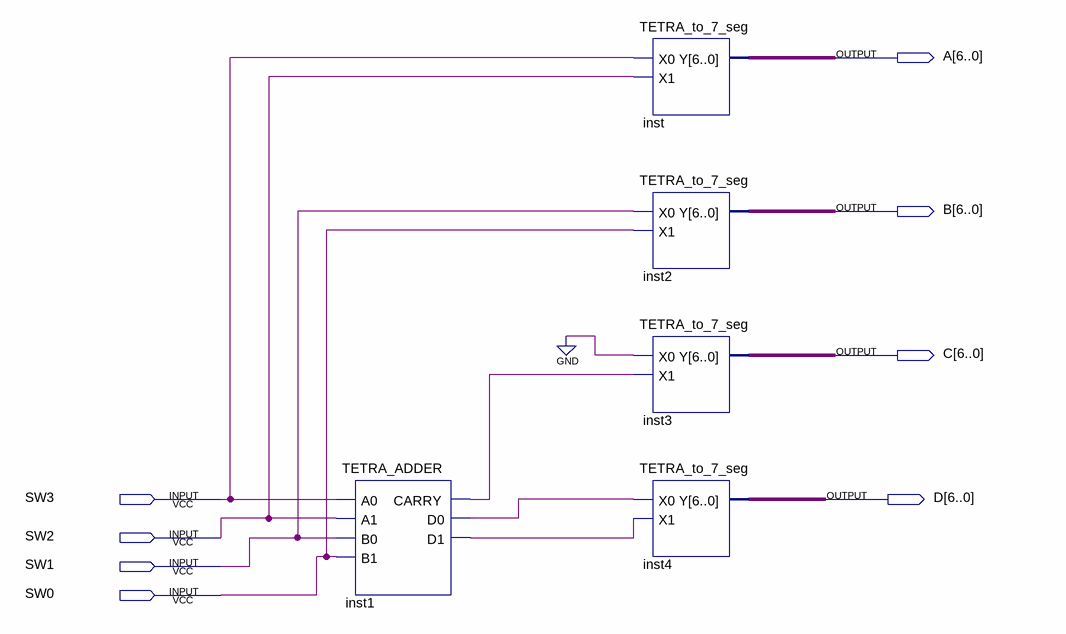
[diagram p0: schematic sheet]
// Quartus schematic Lab2.bdf as structural Verilog: 5 symbols, 8 pins
module Lab2 (
  input  SW3,
  input  SW2,
  input  SW1,
  input  SW0,
  output [6:0] A,
  output [6:0] B,
  output [6:0] C,
  output [6:0] D
);

  wire inst1_carry, inst1_d0, inst1_d1;

  TETRA_ADDER inst1 (.A0(SW3), .A1(SW2), .B0(SW1), .B1(SW0), .CARRY(inst1_carry), .D0(inst1_d0), .D1(inst1_d1));
  TETRA_to_7_seg inst (.X0(SW3), .X1(SW2), .Y(A));
  TETRA_to_7_seg inst2 (.X0(SW1), .X1(SW0), .Y(B));
  TETRA_to_7_seg inst3 (.X0(1'b0), .X1(inst1_carry), .Y(C));
  TETRA_to_7_seg inst4 (.X0(inst1_d0), .X1(inst1_d1), .Y(D));
endmodule
